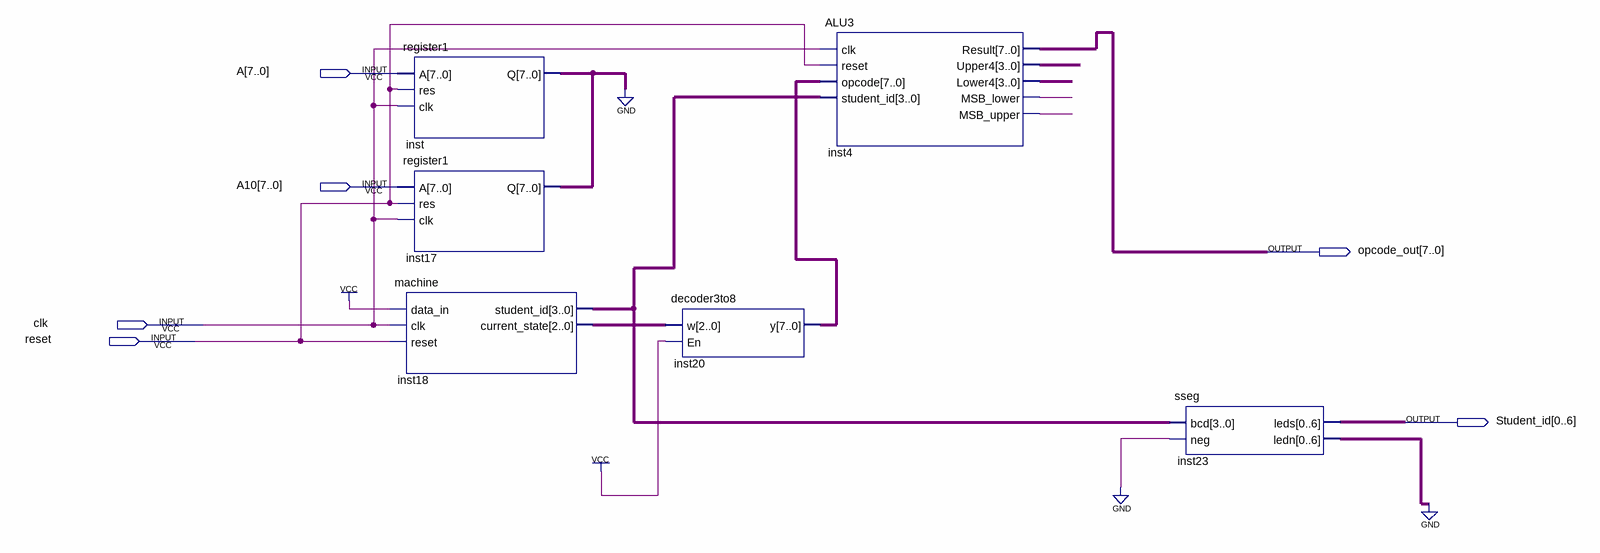
[diagram p0: schematic sheet]
// Quartus schematic PartC.bdf as structural Verilog: 6 symbols, 6 pins
module PartC (
  input  [7:0] A,
  input  [7:0] A10,
  input  clk,
  input  reset,
  output [7:0] opcode_out,
  output [0:6] Student_id
);

  wire inst4_msb_lower, inst4_msb_upper;
  wire [2:0] inst18_current_state;
  wire [3:0] inst4_lower4, inst4_upper4, inst18_student_id;
  wire [6:0] inst23_ledn;
  wire [7:0] inst20_y, inst_q;

  register1 inst (.res(reset), .clk(clk), .Q(inst_q));  // open: A
  register1 inst17 (.res(reset), .clk(clk), .Q(inst_q));  // open: A
  machine inst18 (
    .data_in(1'b1), .clk(clk), .reset(reset), .student_id(inst18_student_id),
    .current_state(inst18_current_state));
  decoder3to8 inst20 (.w(inst18_current_state), .En(1'b1), .y(inst20_y));
  ALU3 inst4 (
    .clk(clk), .reset(reset), .opcode(inst20_y), .student_id(inst18_student_id), .Result(opcode_out),
    .Upper4(inst4_upper4), .Lower4(inst4_lower4), .MSB_lower(inst4_msb_lower), .MSB_upper(inst4_msb_upper));
  sseg inst23 (.bcd(inst18_student_id), .neg(1'b0), .leds(Student_id), .ledn(inst23_ledn));
  // also tied to GND on the sheet: {inst23_ledn[0], inst23_ledn[1], inst23_ledn[2], inst23_ledn[3], inst23_ledn[4], inst23_ledn[5], inst23_ledn[6], inst_q[0], inst_q[1], inst_q[2], inst_q[3], inst_q[4], inst_q[5], inst_q[6], inst_q[7]}
endmodule
